# Altium schematic sheet Lownoise_auxReg.SchDoc
size 431 x 279 mm; SheetNumber: 8; SheetTotal: 8
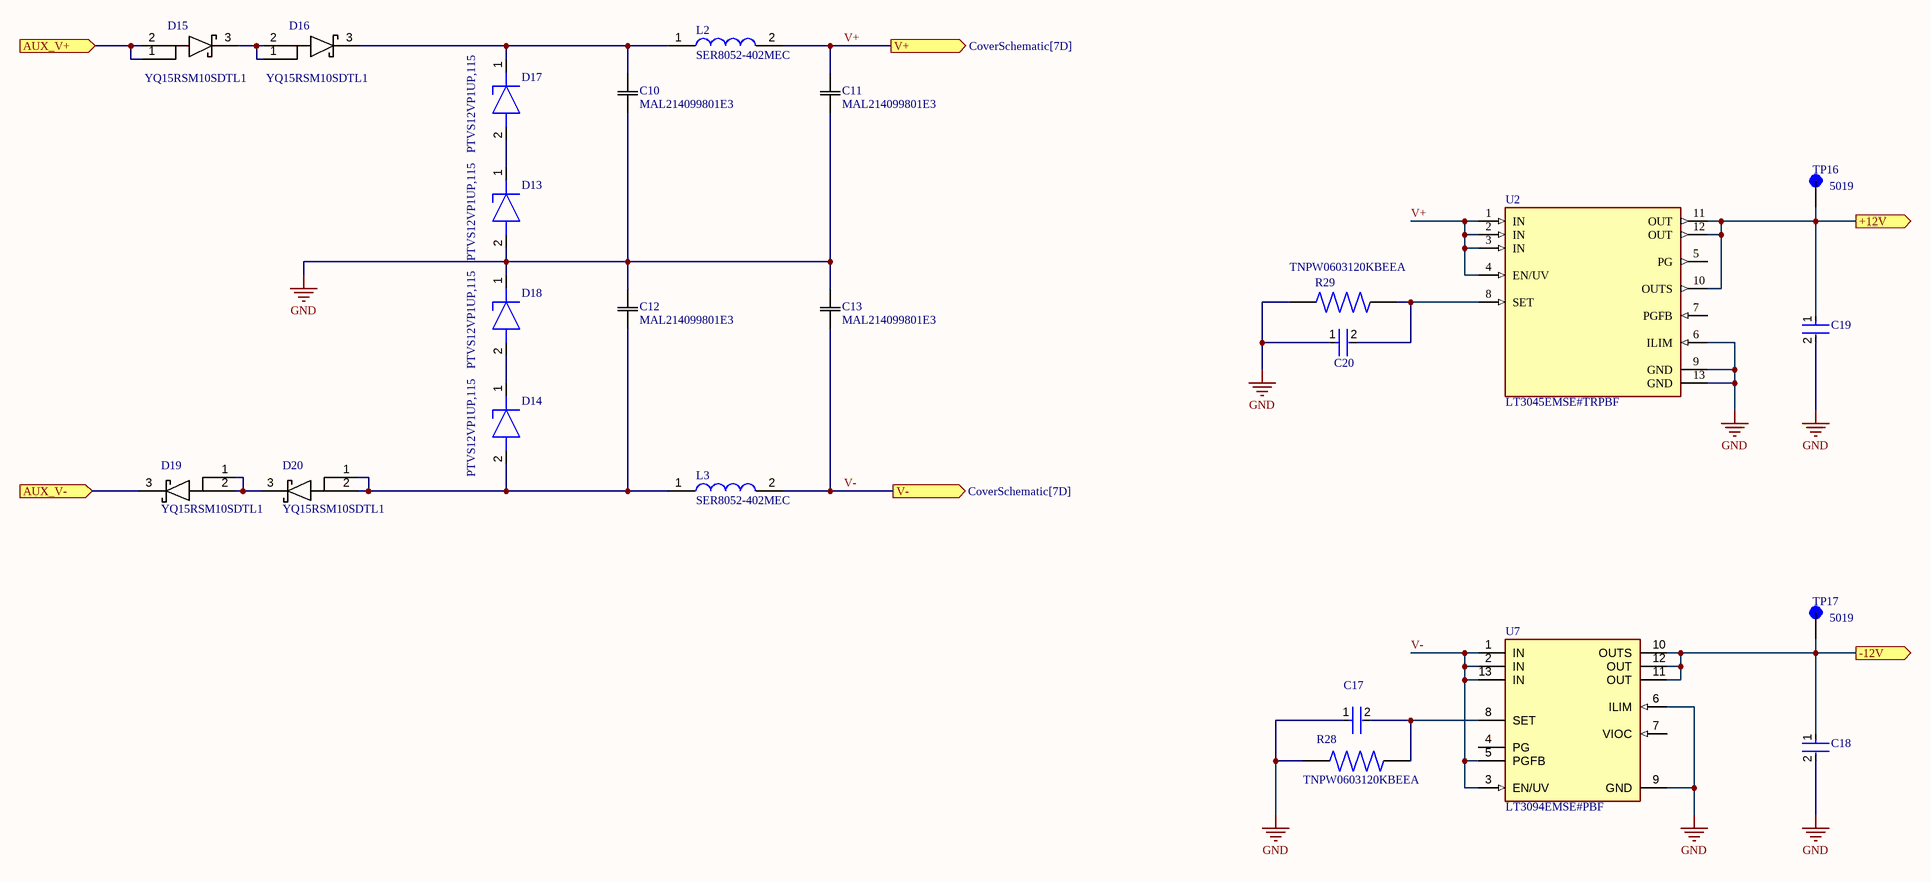
[diagram p0: Lownoise_auxReg.SchDoc]

## Parts
C10  MAL214099801E3  [CAP_140CRH_1010_VIS]
C11  MAL214099801E3  [CAP_140CRH_1010_VIS]
C12  MAL214099801E3  [CAP_140CRH_1010_VIS]
C13  MAL214099801E3  [CAP_140CRH_1010_VIS]
C17  GRM31CR71E106KA12L  [FP-GRM31C-0_2-e0_3_0_8-MFG]  (value not drawn)
C18  GRM31CR71E106KA12L  [FP-GRM31C-0_2-e0_3_0_8-MFG]  (value not drawn)
C19  GRM31CR71E106KA12L  [FP-GRM31C-0_2-e0_3_0_8-MFG]  (value not drawn)
C20  GRM31CR71E106KA12L  [FP-GRM31C-0_2-e0_3_0_8-MFG]  (value not drawn)
D13  PTVS12VP1UP,115  [PMEG3050EP115]
D14  PTVS12VP1UP,115  [PMEG3050EP115]
D15  YQ15RSM10SDTL1  [YQ15RSM10SDTL1]
D16  YQ15RSM10SDTL1  [YQ15RSM10SDTL1]
D17  PTVS12VP1UP,115  [PMEG3050EP115]
D18  PTVS12VP1UP,115  [PMEG3050EP115]
D19  YQ15RSM10SDTL1  [YQ15RSM10SDTL1]
D20  YQ15RSM10SDTL1  [YQ15RSM10SDTL1]
L2  SER8052-402MEC  [SER8052402MEC]
L3  SER8052-402MEC  [SER8052402MEC]
R28  TNPW0603120KBEEA  [RESC1508X55N]
R29  TNPW0603120KBEEA  [RESC1508X55N]
TP16  5019  [KEYSTONE_5019]
TP17  5019  [KEYSTONE_5019]
U2  LT3045EMSE#TRPBF  [FP-MSE-12-05-08-1666-IPC_B]
U7  LT3094EMSE#PBF  [FP-MSE-12-05-08-1666-MFG]

## Ports
+12V (out, see CoverSchematic[7D], Reference[9F], SolidStateDosimeter[5C], TemperatureMon[5D], TemperatureMon[6E], TemperatureMon[8D]), -12V (out, see CoverSchematic[6D], PassElement[4C], PassElement[4E], PassElement[4F], SolidStateDosimeter[5B], TemperatureMon[3D], TemperatureMon[3E], TemperatureMon[6D]), AUX_V+ (in, see CoverSchematic[7E]), AUX_V- (in, see CoverSchematic[6E]), V+ (out, see CoverSchematic[7D]), V- (out, see CoverSchematic[7D])

## Nets
GND: C10.1 C11.1 C12.2 C13.2 C17.1 C18.2 C19.2 C20.1 D13.2(A) D18.1(K) R28.1 R29.1 U2.6(ILIM) U2.9(GND) U2.13(GND) U7.6(ILIM) U7.9(GND)
+12V: C19.1 TP16.TP U2.10(OUTS) U2.11(OUT) U2.12(OUT) ; port +12V
-12V: C18.1 TP17.TP U7.10(OUTS) U7.11(OUT) U7.12(OUT) ; port -12V
AUX_V+: D15.1(A1) D15.2(A2) ; port AUX_V+
AUX_V-: D19.3(K) ; port AUX_V-
V+: C11.2 L2.2 U2.1(IN) U2.2(IN) U2.3(IN) U2.4(EN/UV) ; port V+
V-: C13.1 L3.2 U7.1(IN) U7.2(IN) U7.3(EN/UV) U7.5(PGFB) U7.13(IN) ; port V-
NetC10_2: C10.2 D16.3(K) D17.1(K) L2.1
NetC12_1: C12.1 D14.2(A) D20.1(A1) D20.2(A2) L3.1
NetC17_2: C17.2 R28.2 U7.8(SET)
NetC20_2: C20.2 R29.2 U2.8(SET)
NetD13_1: D13.1(K) D17.2(A)
NetD14_1: D14.1(K) D18.2(A)
NetD15_3: D15.3(K) D16.1(A1) D16.2(A2)
NetD19_1: D19.1(A1) D19.2(A2) D20.3(K)

Not connected (* = marked no-connect by the designer): L2 3; L3 3; U2 5(PG) 7(PGFB); U7 4(PG) 7(VIOC)

## Notes on the sheet
- DWG. NO.
- REV.
- SHT.
- THIS DOCUMENT AND THE DATA DISCLOSED HEREIN OR HEREWITH IS THE PROPERTY OF ALTIUM LIMITED AND MAY BE FREELY DISTRIBUTED IN WHOLE. NO RIGHTS ARE RESERVED OR EXPRESS OR IMPLIED WARANTEE GIVEN.
- REVISION
- DESCRIPTION
- DATE
- APPROVED
- TITLE
- PROJECT
- SCALE:
- B
- SIZE
- CAGE CODE
- FILE NAME
- DWG by:
- Heitor Sampaio Mendes
- SHEET
- OF
- REV

## Library data of the parts
C10-C13 = MAL214099801E3: No Description Available; Mfr_Name: Vishay
C17-C20 = CMP-06035-003589-1: Chip Multilayer Ceramic Capacitors for General Purpose, 1206, 10uF, X7R, 15%, 10%, 25V; Case Code (Imperial): 1206; Voltage Rating (DC): 25V; Voltage Rating: 25V; Length: 3.2mm; Lead Free: Lead Free; Thickness: 0.071inch; Package Quantity: 1; Width: 1.6mm; Max Operating Temperature: 125°C; Number of Pins: 2; Height: 1.6mm; Case Code (Metric): 3216; REACH SVHC: No SVHC; Radiation Hardening: No; Case/Package: 1206; Material: Ceramic; Tolerance: 10%; Voltage: 25V; Mount: Surface Mount; Packaging: Tape and Reel; Dielectric: X7R; Termination: SMD/SMT; Min Operating Temperature: -55°C; Capacitance: 10uF; Depth: 1.6mm
D13 D14 D17 D18 = PTVS12VP1UP,115: Diode ESD (Uni-directional); Manufacturer_Name: Nexperia; Datasheet Link: https://assets.nexperia.com/documents/data-sheet/PTVSXP1UP_SER.pdf; Height: 1mm; Manufacturer_Part_Number: PTVS12VP1UP,115; Mouser Part Number: 771-PTVS12VP1UP115; Mouser Price/Stock: https://www.mouser.co.uk/ProductDetail/Nexperia/PTVS12VP1UP115?qs=5eMHoInnifTeU9%2FVxPGuCA%3D%3D; Arrow Part Number: PTVS12VP1UP,115; Arrow Price/Stock: https://www.arrow.com/en/products/ptvs12vp1up115/nexperia
D15 D16 D19 D20 = YQ15RSM10SDTL1: Schottky Diode; Manufacturer_Name: ROHM Semiconductor; Datasheet Link: https://fscdn.rohm.com/en/products/databook/datasheet/discrete/diode/schottky_barrier/yq15rsm10sdtl1-e.pdf; Height: 1.2mm; Manufacturer_Part_Number: YQ15RSM10SDTL1; Mouser Part Number: 755-YQ15RSM10SDTL1; Mouser Price/Stock: https://www.mouser.co.uk/ProductDetail/ROHM-Semiconductor/YQ15RSM10SDTL1?qs=Z%252BL2brAPG1JP7erh913hZg%3D%3D
L2 L3 = SER8052-402MEC: Inductor; Manufacturer_Name: COILCRAFT; Datasheet Link: https://www.coilcraft.com/getmedia/f704c02a-b3a0-4aab-a2f9-03662c81c40d/ser80xx.pdf; Height: 5.2mm; Manufacturer_Part_Number: SER8052-402MEC; Mouser Part Number: 994-SER8052-402MEC; Mouser Price/Stock: https://www.mouser.co.uk/ProductDetail/Coilcraft/SER8052-402MEC?qs=mBwMfv9Clf3lT8OdMPOqNQ%3D%3D
R28 R29 = TNPW0603120KBEEA: MF: {'manufacturer': u'Vishay'}; Package: None; Price: None; Value: *; MP: TNPW0603120KBEEA; Availability: Unavailable
TP16 TP17 = 5019: MF: {'manufacturer': u'Keystone Electronics'}; Package: None; Price: None; Value: *; MP: 5019; Availability: Unavailable
U2 = CMP-09138-000053-1: IC REG LINEAR 0V 500MA 12MSOP; Case/Package: MSOP; RoHS Compliant: Yes
U7 = CMP-09138-000010-1: IC REG LIN NEG ADJ 500MA 12MSOP; Manufacturer: Analog Devices; Standoff Height: 0.0508mm; Number Of Outputs: 1; Min Supply Voltage: -20V; Max Junction Temp: +150°C; Output Voltage: 0/-12V; Dropout Voltage: 235mV; Output Type: AdjustableProgrammable; Nominal Supply Current: 3uA; Max Supply Voltage: -2.3V; Accuracy Percentage: 1%; Output Current: 100uA; Device Class L1: Integrated Circuits (ICs); Device Class L3: Voltage Regulators - Linear; Manufacturer Part Number: LT3094EMSE#PBF; Device Class L2: Power Management ICs; Ipc Land Pattern Name: SOP65P404X110-12; Mouser Description: LDO Regulator Neg 0V to -19.5V 0.5A 12-Pin MSOP EP Tube; Digikey Description: IC REG LIN NEG ADJ 500MA 12MSOP; Automotive: No; Temperature Range Low: -40°C; Temperature: -40°C to +125°C; ComponentLink2URL: https://www.analog.com/media/en/technical-documentation/data-sheets/LT3094.pdf; Temperature Range High: +125°C; RoHS: TRUE; Category: IC; ComponentLink2Description: Datasheet; Octopart: https://octopart.com/lt3094emse%23pbf-analog+devices-95403590; Package: MSE-12-05-08-1666; Lead Free: Yes; Height: 1.1mm